# Altium schematic sheet ZenDriver_Mini2.SchDoc
size A4
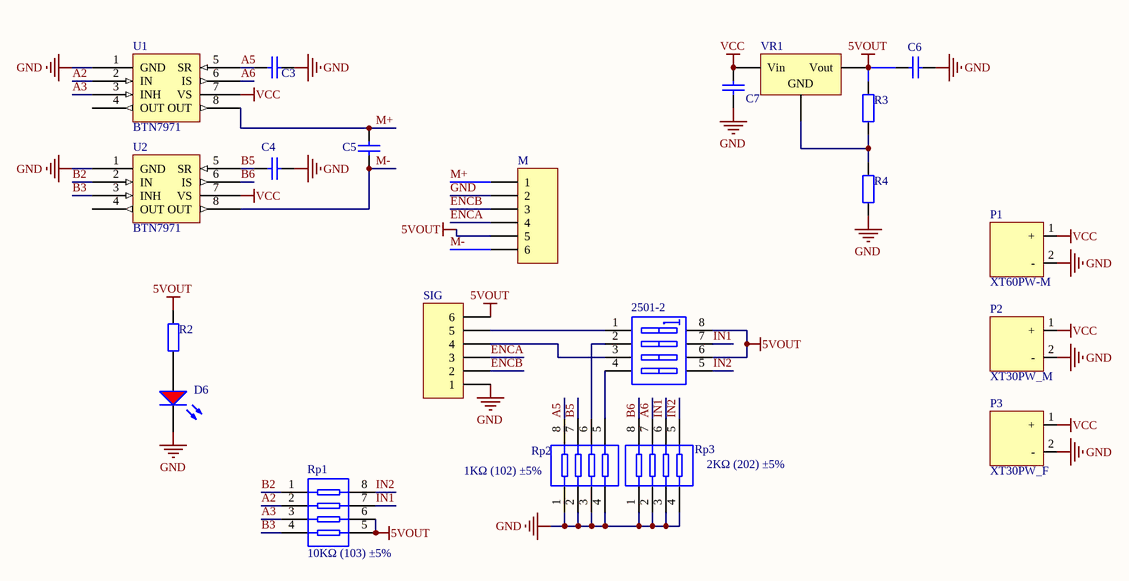
[diagram p0: ZenDriver_Mini2.SchDoc]

## Parts
2501-2  2501-2  [*DIP762W50P254L977H451Q8]  (value not drawn)
C3  100nF (104) 10% 50V  [0603_C]  (value not drawn)
C4  100nF (104) 10% 50V  [0603_C]  (value not drawn)
C5  22pF (220) 5% 50V  [0603_C]  (value not drawn)
C6  100nF (104) 10% 50V  [0603_C]  (value not drawn)
C7  100nF (104) 10% 50V  [0603_C]  (value not drawn)
D6  红灯 0603  [0603_LED_S1]  (value not drawn)
M  Header 6H  [HDR1X6H]  (value not drawn)
P1  XT60PW-M  [XT60PW-M]
P2  XT30PW_M  [XT30PW-M]
P3  XT30PW_F  [XT30PW-F]
R2  4.7k  [0603_R]  (value not drawn)
R3  1KΩ (1001) ±1%  [0603_R]  (value not drawn)
R4  3KΩ (3001) ±1%  [0603_R]  (value not drawn)
Rp1  10KΩ (103) ±5%  [0603_Rx4]
Rp2  1KΩ (102) ±5%  [0603_Rx4]
Rp3  2KΩ (202) ±5%  [0603_Rx4]
SIG  Header 6H  [HDR1X6H]  (value not drawn)
U1  BTN7971  [DPAK127P1615X127-8N]
U2  BTN7971  [DPAK127P1615X127-8N]
VR1  LM317AL-TN3-R  [TO-252-2-180]  (value not drawn)

## Nets
5VOUT: 2501-2.6(B3) 2501-2.8(B1) C6.1 M.5 R2.2 R3.2 Rp1.5 Rp1.6 SIG.6 VR1.2(Vout)
GND: C3.2 C4.2 C6.2 C7.1 D6.K M.2 P1.2(-) P2.2(-) P3.2(-) R4.1 Rp2.1 Rp2.2 Rp2.3 Rp2.4 Rp3.1 Rp3.2 Rp3.3 Rp3.4 SIG.1 U1.1(GND) U2.1(GND)
VCC: C7.2 P1.1(+) P2.1(+) P3.1(+) U1.7(VS) U2.7(VS) VR1.3(Vin)
A2: Rp1.2 U1.2(IN)
A3: Rp1.3 U1.3(INH)
A5: C3.1 Rp2.8 U1.5(SR)
A6: Rp3.7 U1.6(IS)
B2: Rp1.1 U2.2(IN)
B3: Rp1.4 U2.3(INH)
B5: C4.1 Rp2.7 U2.5(SR)
B6: Rp3.8 U2.6(IS)
ENCA: M.4 SIG.3
ENCB: M.3 SIG.2
IN1: 2501-2.7(B2) Rp1.7 Rp3.6
IN2: 2501-2.5(B4) Rp1.8 Rp3.5
M+: C5.2 M.1 U1.8(OUT)
M-: C5.1 M.6 U2.8(OUT)
Net2501-2_1: 2501-2.1(A1) SIG.5
Net2501-2_2: 2501-2.2(A2) Rp2.6
Net2501-2_3: 2501-2.3(A3) SIG.4
Net2501-2_4: 2501-2.4(A4) Rp2.5
NetD6_A: D6.A R2.1
NetR3_1: R3.1 R4.2 VR1.1(GND)

Not connected (* = marked no-connect by the designer): U1 4(OUT); U2 4(OUT)

## Library data of the parts
2501-2 = SW DIP-4: DIP Switch, 4 Position, SPST; Published: 24-Mar-1999; LatestRevisionDate: 29-May-2009; LatestRevisionNote: IPC-7351 Footprint Added.; PackageVersion: Dec-2002; PackageReference: SO8; Publisher: Altium Limited; PackageDescription: 8-Pin Small Outline Integrated Circuit 1.27 mm Pitch; Code_JEDEC: MS-012-AA; Code_IPC: SOIC127P600-8
C3 C4 C6 C7 = 0603 100nF (104) 10% 50V: 贴片电容; ComponentLink1Description: 供应商链接; ComponentLink1URL: http://www.szlcsc.com/product/details_15331.html; Package: 0603; Supplier: LC; SuppliersPartNumber: C14663
C5 = 0603 22pF (220) 5% 50V: 贴片电容; ComponentLink1Description: 供应商链接; ComponentLink1URL: http://www.szlcsc.com/product/details_2005.html; Package: 0603; Supplier: LC; SuppliersPartNumber: C1653
D6 = 0603 红灯: 发光二极管; ComponentLink1Description: 供应商链接; ComponentLink1URL: http://www.szlcsc.com/product/details_2659.html; Package: 0603; Supplier: LC; SuppliersPartNumber: C2286
M SIG = Header 6H: Header, 6-Pin, Right Angle; LatestRevisionDate: 17-Jul-2002; LatestRevisionNote: Re-released for DXP Platform.; Publisher: Altium Limited
P1 = XT60
P2 P3 = XT30
R2 = 0603 470Ω (4700) 1%: 贴片电阻; ComponentLink1Description: 供应商链接; ComponentLink1URL: http://www.szlcsc.com/product/details_23906.html; Package: 0603; Supplier: LC; SuppliersPartNumber: C23179
R3 = 0603 1KΩ (1001) 1%: 贴片电阻; ComponentLink1Description: 供应商链接; ComponentLink1URL: http://www.szlcsc.com/product/details_21904.html; Package: 0603; Supplier: LC; SuppliersPartNumber: C21190
R4 = 0603 3KΩ (3001) 1%: 贴片电阻; ComponentLink1Description: 供应商链接; ComponentLink1URL: http://www.szlcsc.com/product/details_4618.html; Package: 0603; Supplier: LC; SuppliersPartNumber: C4211
Rp1 = 0603*4  10KΩ (103) 5%: 贴片排阻; ComponentLink1Description: 供应商链接; ComponentLink1URL: http://www.szlcsc.com/product/details_30472.html; Package: 0603*4; Supplier: LC; SuppliersPartNumber: C29718
Rp2 Rp3 = 0603*4  1KΩ (102) 5%: 贴片排阻; ComponentLink1Description: 供应商链接; ComponentLink1URL: http://www.szlcsc.com/product/details_20907.html; Package: 0603*4; Supplier: LC; SuppliersPartNumber: C20197
VR1 = TO-252-2 LM317AL-TN3-R: 低压差线性稳压(LDO); ComponentLink1Description: 供应商链接; ComponentLink1URL: http://www.szlcsc.com/product/details_76635.html; Package: TO-252-2; Supplier: LC; SuppliersPartNumber: C75510